# EAGLE design Nano Breakout (EAGLE 6.5.0)
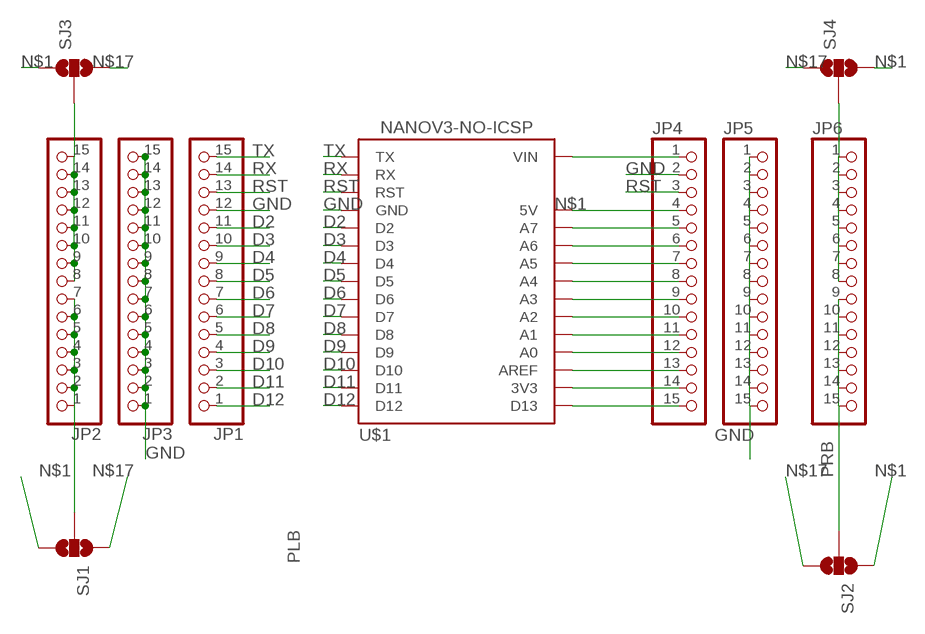
[diagram p0: schematic, sheet 1]

## Parts
JP1  PINHD-1X15  [1X15]
JP2  PINHD-1X15  [1X15]
JP3  PINHD-1X15  [1X15]
JP4  PINHD-1X15  [1X15]
JP5  PINHD-1X15  [1X15]
JP6  PINHD-1X15  [1X15]
SJ1  JUMPER-PAD-3-NOFULL_BOX_SILK  [PAD-JUMPER-3-NO_YES_SILK_FULL_BOX]
SJ2  JUMPER-PAD-3-NOFULL_BOX_SILK  [PAD-JUMPER-3-NO_YES_SILK_FULL_BOX]
SJ3  JUMPER-PAD-3-NOFULL_BOX_SILK  [PAD-JUMPER-3-NO_YES_SILK_FULL_BOX]
SJ4  JUMPER-PAD-3-NOFULL_BOX_SILK  [PAD-JUMPER-3-NO_YES_SILK_FULL_BOX]
U$1  NANOV3-NO-ICSP  [NANOV3-NO-ICSP]

## Nets
D2: JP1.11 U$1.D2
D3: JP1.10 U$1.D3
D4: JP1.9 U$1.D4
D5: JP1.8 U$1.D5
D6: JP1.7 U$1.D6
D7: JP1.6 U$1.D7
D8: JP1.5 U$1.D8
D9: JP1.4 U$1.D9
D10: JP1.3 U$1.D10
D11: JP1.2 U$1.D11
D12: JP1.1 U$1.D12
GND: JP1.12 JP3.1 JP3.2 JP3.3 JP3.4 JP3.5 JP3.6 JP3.7 JP3.8 JP3.9 JP3.10 JP3.11 JP3.12 JP3.13 JP3.14 JP3.15 JP4.2 JP5.1 JP5.2 JP5.3 JP5.4 JP5.5 JP5.6 JP5.7 JP5.8 JP5.9 JP5.10 JP5.11 JP5.12 JP5.13 JP5.14 JP5.15 U$1.GND@1(GND) U$1.GND@2(GND)
N$1: JP4.4 SJ1.3 SJ2.1 SJ3.1 SJ4.3 U$1.5V
N$2: JP2.8 JP2.9 JP2.10 JP2.11 JP2.12 JP2.13 JP2.14 JP2.15 SJ3.2
N$3: JP4.15 U$1.D13
N$4: JP6.1 JP6.2 JP6.3 JP6.4 JP6.5 JP6.6 JP6.7 JP6.8 SJ4.2
N$5: JP4.13 U$1.AREF
N$6: JP4.12 U$1.A0
N$7: JP4.11 U$1.A1
N$8: JP4.10 U$1.A2
N$9: JP4.9 U$1.A3
N$10: JP4.8 U$1.A4
N$11: JP4.7 U$1.A5
N$12: JP4.6 U$1.A6
N$13: JP4.5 U$1.A7
N$14: JP4.1 U$1.VIN
N$17: JP4.14 SJ1.1 SJ2.3 SJ3.3 SJ4.1 U$1.3V3
PLB: JP2.1 JP2.2 JP2.3 JP2.4 JP2.5 JP2.6 JP2.7 SJ1.2
PRB: JP6.9 JP6.10 JP6.11 JP6.12 JP6.13 JP6.14 JP6.15 SJ2.2
RST: JP1.13 JP4.3 U$1.RST1(RST) U$1.RST2(RST)
RX: JP1.14 U$1.RX
TX: JP1.15 U$1.TX

## Library data of the parts
JP1-JP6 = pinhead:PINHD-1X15: PIN HEADER
SJ1-SJ4 = SparkFun-Passives:JUMPER-PAD-3-NO
U$1 = Franc:NANOV3-NO-ICSP: Nano V3 without the ICSP header

## Board
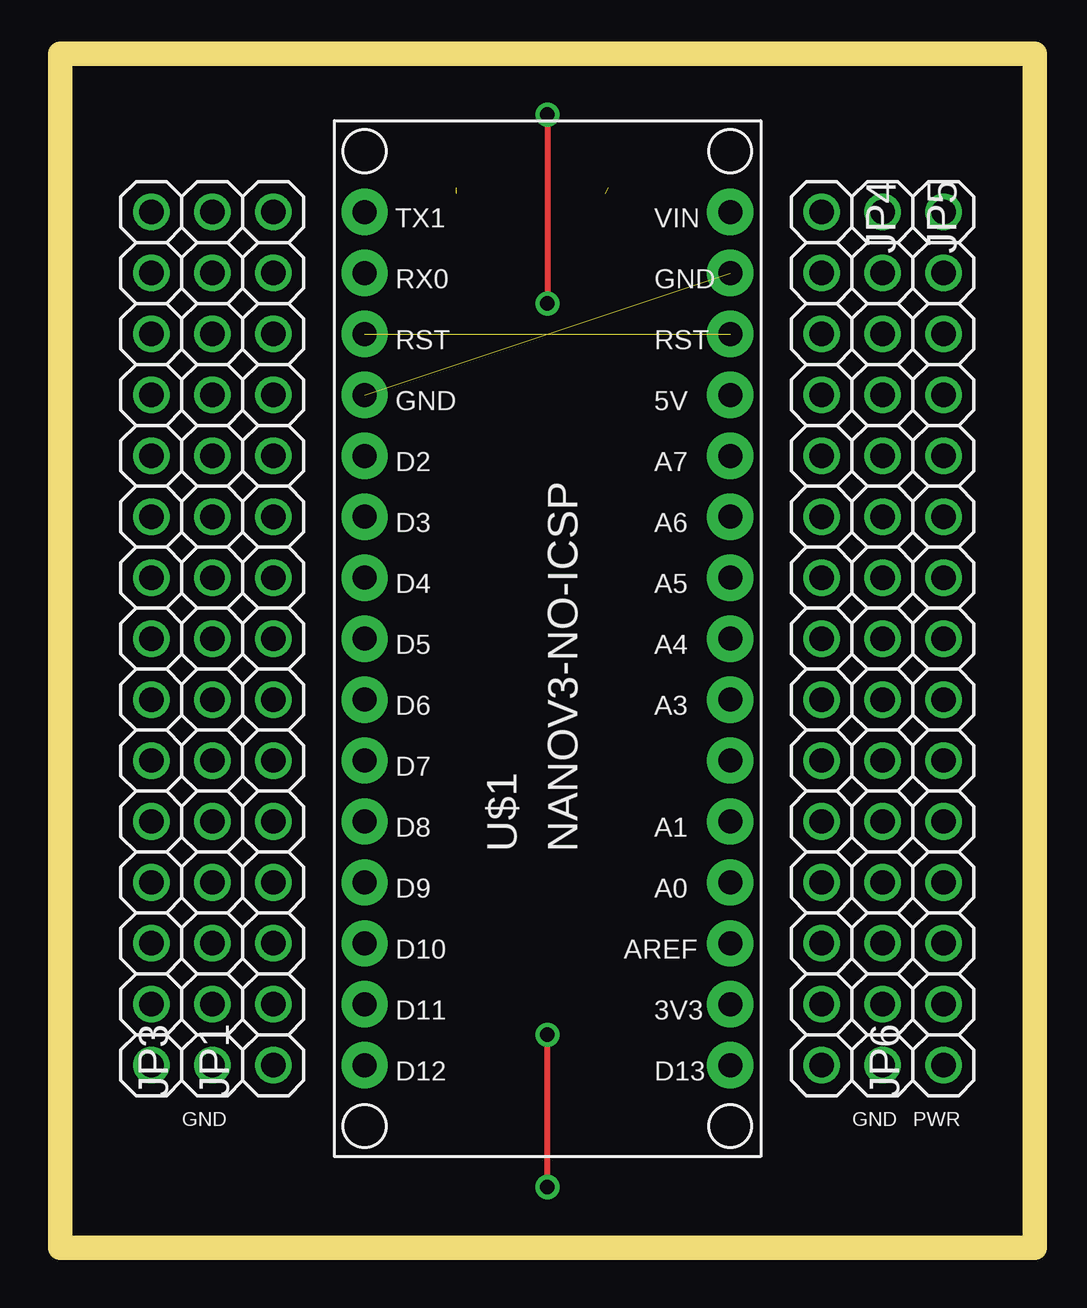
[diagram p1: board, top side]
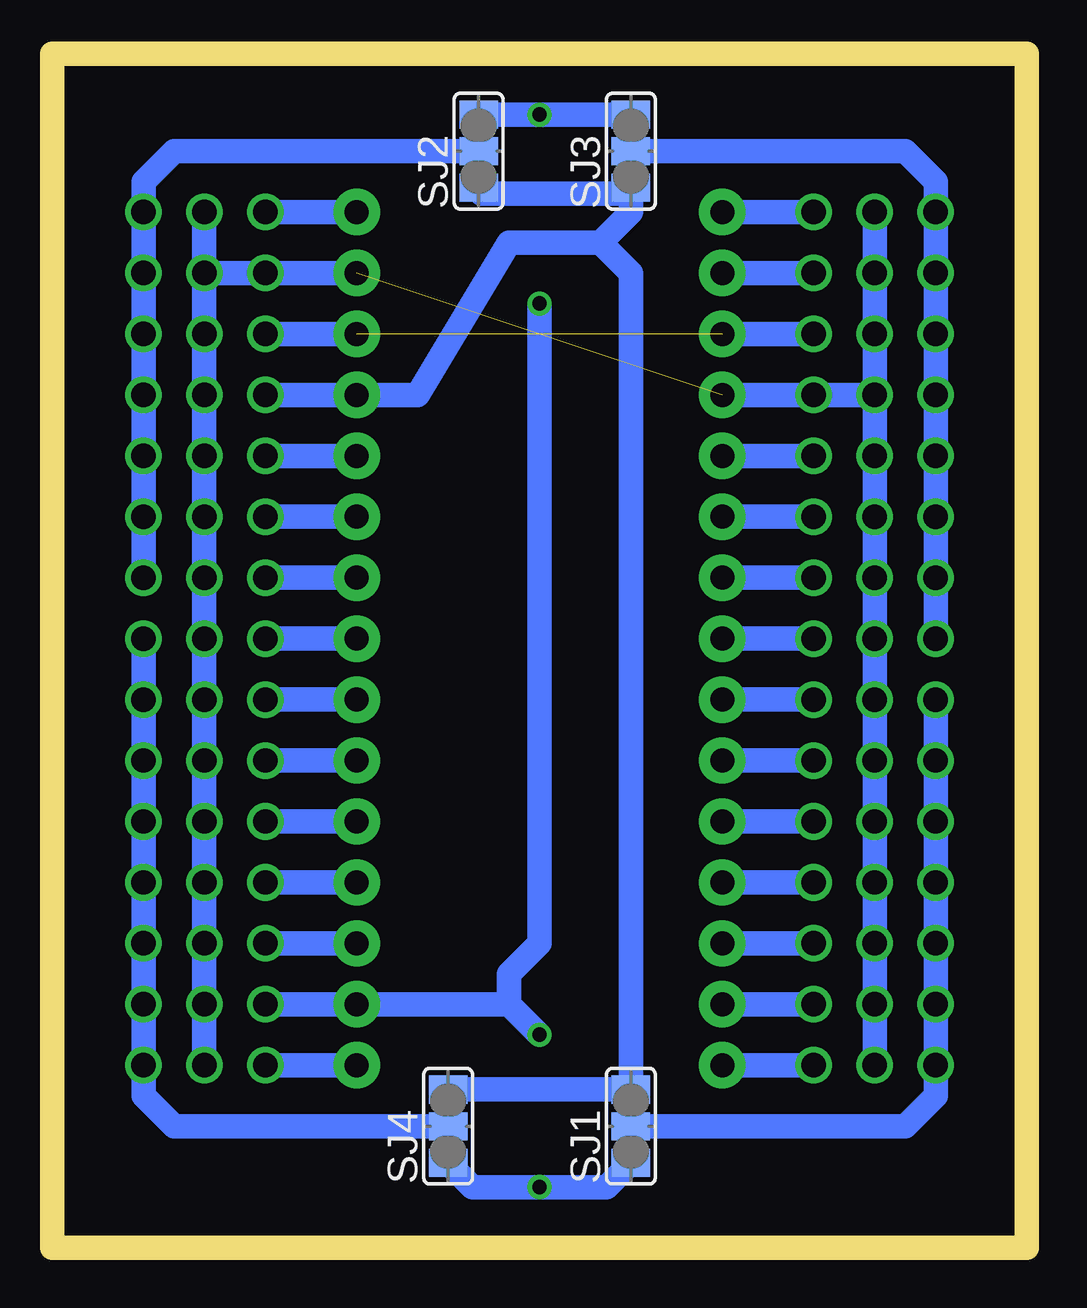
[diagram p2: board, bottom side, seen from below]

Size 40.31 x 49.52 mm. Coordinates in mm from the lower left corner, seen from the top.
Outline: 0,0 40.31,0 40.31,49.52
Copper layers (1*16): Top 0.035mm / dielectric 1.5mm / Bottom 0.035mm
Design rules "default": minimum track width 10mil, minimum drill 24mil, track to track 8mil, track to pad 8mil, pad to pad 8mil, via to via 8mil, smd to smd 8mil, copper to edge 40mil, drill to drill 8mil, minimum pad ring 10mil, minimum via ring 8mil, stop-mask expansion 4mil, vias tented up to drill 0mil, thermal gap 10mil
Milling: 4 lines

### Footprints (pad centres in the part's own frame; a part is rotated, then mirrored left to right if it is on the bottom)
1X15 = drill 1.016: 1 -17.78,0; 2 -15.24,0; 3 -12.7,0; 4 -10.16,0; 5 -7.62,0; 6 -5.08,0; 7 -2.54,0; 8 0,0; 9 2.54,0; 10 5.08,0; 11 7.62,0; 12 10.16,0; 13 12.7,0; 14 15.24,0; 15 17.78,0
PAD-JUMPER-3-NO_YES_SILK_FULL_BOX = smd 1.168 x 1.6: 1 -1.524,0; 2 0,0; 3 1.524,0
NANOV3-NO-ICSP = drill 1 pad 1.93: 3V3 3.81,-13.97; 5V 3.81,11.43; A0 3.81,-8.89; A1 3.81,-6.35; A2 3.81,-3.81; A3 3.81,-1.27; A4 3.81,1.27; A5 3.81,3.81; A6 3.81,6.35; A7 3.81,8.89; AREF 3.81,-11.43; D2 -11.43,8.89; D3 -11.43,6.35; D4 -11.43,3.81; D5 -11.43,1.27; D6 -11.43,-1.27; D7 -11.43,-3.81; D8 -11.43,-6.35; D9 -11.43,-8.89; D10 -11.43,-11.43; D11 -11.43,-13.97; D12 -11.43,-16.51; D13 3.81,-16.51; GND@1 -11.43,11.43; GND@2 3.81,16.51; RST1 -11.43,13.97; RST2 3.81,13.97; RX -11.43,16.51; TX -11.43,19.05; VIN 3.81,19.05

### Placement (x,y rotation side)
JP1  8.89,25.4 90 top
JP2  3.81,25.4 90 top
JP3  6.35,25.4 90 top
JP4  31.75,25.4 270 top
JP5  34.29,25.4 270 top
JP6  36.83,25.4 90 top
SJ1  16.51,5.08 90 bottom
SJ2  22.86,45.72 90 bottom
SJ3  16.51,45.72 90 bottom
SJ4  24.13,5.08 90 bottom
U$1  24.13,24.13 0 top

### Tracks (layer width: path | path; a pad name or v marks a point on that pad's centre or on a via)
D2
  Bottom 1.016: JP1.11 U$1.D2
D3
  Bottom 1.016: JP1.10 U$1.D3
D4
  Bottom 1.016: JP1.9 U$1.D4
D5
  Bottom 1.016: JP1.8 U$1.D5
D6
  Bottom 1.016: JP1.7 U$1.D6
D7
  Bottom 1.016: JP1.6 U$1.D7
D8
  Bottom 1.016: JP1.5 U$1.D8
D9
  Bottom 1.016: JP1.4 U$1.D9
D10
  Bottom 1.016: JP1.3 U$1.D10
D11
  Bottom 1.016: JP1.2 U$1.D11
D12
  Bottom 1.016: JP1.1 U$1.D12
GND  (1 unrouted)
  Bottom 1.016: JP3.1 JP3.2 JP3.3 JP3.4 JP3.5 JP3.6 JP3.7 JP3.8 JP3.9 JP3.10 JP3.11 JP3.12 | JP3.12 JP3.13 JP3.14 JP3.15 | U$1.GND@1 JP1.12 JP3.12 | U$1.GND@2 JP4.2 | JP4.2 33.02,40.64 | JP5.1 JP5.2 | JP5.2 JP5.3 JP5.4 JP5.5 JP5.6 JP5.7 JP5.8 JP5.9 JP5.10 JP5.11 JP5.12 JP5.13 JP5.14 JP5.15 | JP4.2 JP5.2
N$1  (2 unrouted)
  Bottom 1.016: JP4.4 U$1.5V 25.4,35.56 21.59,41.91 17.78,41.91 | 22.73,43.94 16.51,43.94 16.51,43.18 17.78,41.91 | 17.78,41.91 16.51,40.64 SJ1.3 SJ4.3
N$2
  Bottom 1.016: JP2.8 JP2.9 JP2.10 JP2.11 JP2.12 JP2.13 JP2.14 JP2.15 3.81,44.45 5.08,45.72 SJ3.2
N$3
  Bottom 1.016: U$1.D13 JP4.15
N$4
  Bottom 1.016: JP6.8 JP6.7 JP6.6 JP6.5 JP6.4 JP6.3 JP6.2 JP6.1 36.83,6.35 35.56,5.08 SJ4.2
N$5
  Bottom 1.016: U$1.AREF JP4.13
N$6
  Bottom 1.016: U$1.A0 JP4.12
N$7
  Bottom 1.016: U$1.A1 JP4.11
N$8
  Bottom 1.016: U$1.A2 JP4.10
N$9
  Bottom 1.016: U$1.A3 JP4.9
N$10
  Bottom 1.016: U$1.A4 JP4.8
N$11
  Bottom 1.016: U$1.A5 JP4.7
N$12
  Bottom 1.016: U$1.A6 JP4.6
N$13
  Bottom 1.016: U$1.A7 JP4.5
N$14
  Bottom 1.016: U$1.VIN JP4.1
N$17  (via drill 0.6 pad 0.81)
  Top 0.254: v20.32,47.24 v20.32,39.37 | v20.32,2.54 v20.32,8.89
  Bottom 1.016: SJ3.3 v20.32,47.24 SJ2.3 | JP4.14 U$1.3V3 21.59,10.16 | 21.59,10.16 v20.32,8.89 | 21.59,10.16 21.59,11.43 20.32,12.7 v20.32,39.37 | SJ1.1 17.53,2.54 v20.32,2.54 23.11,2.54 SJ4.1
PLB
  Bottom 1.016: JP2.7 JP2.6 JP2.5 JP2.4 JP2.3 JP2.2 JP2.1 3.81,6.35 5.08,5.08 SJ1.2
PRB
  Bottom 1.016: JP6.9 JP6.10 JP6.11 JP6.12 JP6.13 JP6.14 JP6.15 36.83,44.45 35.56,45.72 SJ2.2
RST  (1 unrouted)
  Bottom 1.016: JP1.13 U$1.RST1 | U$1.RST2 JP4.3
RX
  Bottom 1.016: JP1.14 U$1.RX
TX
  Bottom 1.016: JP1.15 U$1.TX

### Text on the board
tNames: GND | GND | PWR